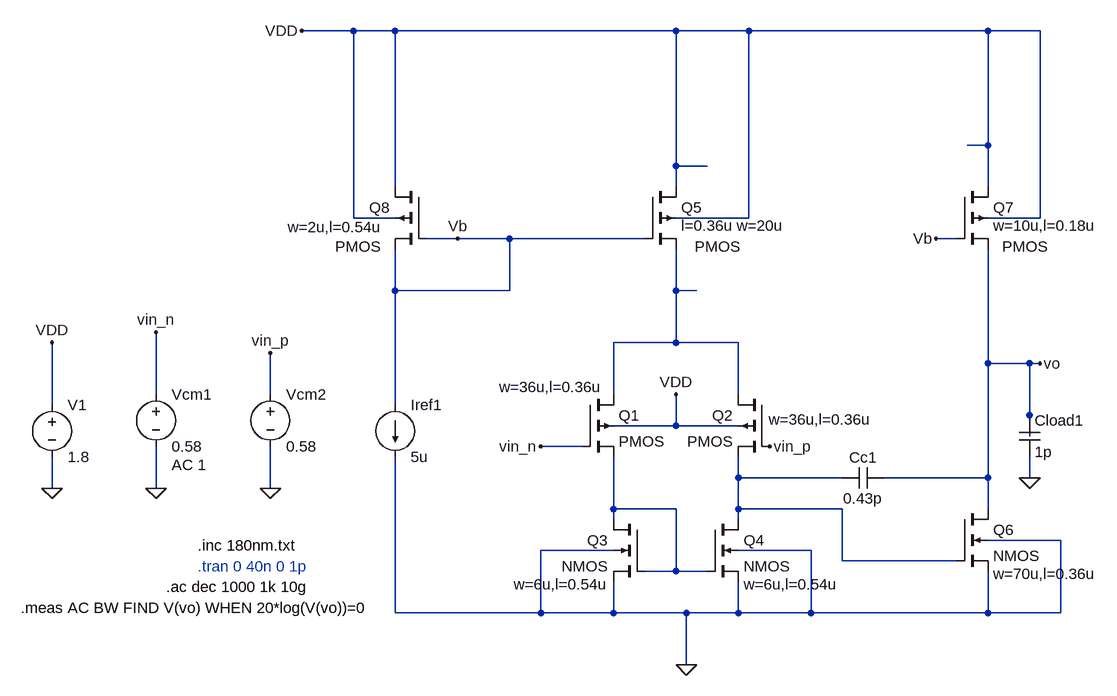
[diagram p0: schematic 55db 180mhz 62degree.asc]
55db 180mhz 62degree.asc, the LTspice schematic file:
Version 4
SHEET 1 1592 680
WIRE -400 -448 -480 -448
WIRE -336 -448 -400 -448
WIRE 96 -448 -336 -448
WIRE 208 -448 96 -448
WIRE 576 -448 208 -448
WIRE 656 -448 576 -448
WIRE 576 -272 576 -448
WIRE 576 -272 544 -272
WIRE 96 -240 96 -448
WIRE 144 -240 96 -240
WIRE -336 -208 -336 -448
WIRE 96 -208 96 -240
WIRE 576 -208 576 -272
WIRE -400 -160 -400 -448
WIRE -336 -160 -400 -160
WIRE 208 -160 208 -448
WIRE 208 -160 96 -160
WIRE 656 -160 656 -448
WIRE 656 -160 576 -160
WIRE -240 -128 -288 -128
WIRE -160 -128 -240 -128
WIRE 48 -128 -160 -128
WIRE 528 -128 496 -128
WIRE -336 -48 -336 -112
WIRE -160 -48 -160 -128
WIRE -160 -48 -336 -48
WIRE 96 -48 96 -112
WIRE 128 -48 96 -48
WIRE 96 32 96 -48
WIRE 96 32 0 32
WIRE 192 32 96 32
WIRE 576 64 576 -112
WIRE 640 64 576 64
WIRE 656 64 640 64
WIRE -704 112 -704 16
WIRE -528 112 -528 48
WIRE 0 112 0 32
WIRE 192 112 192 32
WIRE -864 128 -864 32
WIRE -336 128 -336 -48
WIRE 640 144 640 64
WIRE 96 160 96 112
WIRE 96 160 0 160
WIRE 192 160 96 160
WIRE 640 176 640 144
WIRE -48 192 -112 192
WIRE 192 240 192 208
WIRE 352 240 192 240
WIRE 576 240 576 64
WIRE 576 240 416 240
WIRE 640 240 640 208
WIRE -864 256 -864 208
WIRE -704 256 -704 192
WIRE -528 256 -528 192
WIRE 0 288 0 208
WIRE 96 288 0 288
WIRE 192 288 192 240
WIRE 352 288 192 288
WIRE 576 288 576 240
WIRE 0 304 0 288
WIRE 192 304 192 288
WIRE 688 336 576 336
WIRE 0 352 -112 352
WIRE 304 352 192 352
WIRE 352 368 352 288
WIRE 528 368 352 368
WIRE 96 384 96 288
WIRE 96 384 48 384
WIRE 144 384 96 384
WIRE -336 448 -336 208
WIRE -112 448 -112 352
WIRE -112 448 -336 448
WIRE 0 448 0 400
WIRE 0 448 -112 448
WIRE 112 448 0 448
WIRE 192 448 192 400
WIRE 192 448 112 448
WIRE 304 448 304 352
WIRE 304 448 192 448
WIRE 576 448 576 384
WIRE 576 448 304 448
WIRE 688 448 688 336
WIRE 688 448 576 448
WIRE 112 528 112 448
FLAG -112 192 vin_n
FLAG 240 192 vin_p
FLAG -480 -448 VDD
FLAG 656 64 vo
FLAG -704 256 0
FLAG -528 256 0
FLAG -528 48 vin_p
FLAG -864 256 0
FLAG -864 32 VDD
FLAG 640 240 0
FLAG 112 528 0
FLAG 96 112 VDD
FLAG -240 -128 Vb
FLAG 496 -128 Vb
FLAG -704 16 vin_n
DATAFLAG 96 -48 ""
DATAFLAG 576 64 ""
DATAFLAG 432 368 ""
DATAFLAG 64 288 ""
DATAFLAG 544 -272 "Id(Q7)"
DATAFLAG -128 -128 ""
DATAFLAG 144 -240 "Id(Q2)"
DATAFLAG 0 32 "Id(Q4)"
SYMBOL pmos4 -288 -208 M0
WINDOW 3 70 92 Left 2
WINDOW 123 68 62 Left 2
SYMATTR Value2 w=2u,l=0.54u
SYMATTR InstName Q8
SYMBOL pmos4 48 -208 R0
WINDOW 3 77 92 Left 2
WINDOW 123 56 60 Left 2
SYMATTR Value2 l=0.36u w=20u
SYMATTR InstName Q5
SYMBOL pmos4 528 -208 R0
WINDOW 3 70 92 Left 2
WINDOW 123 56 60 Left 2
SYMATTR Value2 w=10u,l=0.18u
SYMATTR InstName Q7
SYMBOL pmos4 -48 112 R0
WINDOW 123 287 38 Left 2
SYMATTR Value2 w=36u,l=0.36u
SYMATTR InstName Q1
SYMBOL pmos4 240 112 M0
WINDOW 123 257 -12 Left 2
SYMATTR Value2 w=36u,l=0.36u
SYMATTR InstName Q2
SYMBOL nmos4 48 304 M0
WINDOW 123 56 100 Left 2
SYMATTR Value2 w=6u,l=0.54u
SYMATTR InstName Q3
SYMBOL nmos4 144 304 R0
WINDOW 123 56 100 Left 2
SYMATTR Value2 w=6u,l=0.54u
SYMATTR InstName Q4
SYMBOL nmos4 528 288 R0
WINDOW 123 56 100 Left 2
SYMATTR Value2 w=70u,l=0.36u
SYMATTR InstName Q6
SYMBOL cap 416 224 R90
WINDOW 0 0 32 VBottom 2
WINDOW 3 32 32 VTop 2
SYMATTR InstName Cc1
SYMATTR Value 0.43p
SYMBOL voltage -704 96 R0
WINDOW 123 24 124 Left 2
WINDOW 39 0 0 Left 0
SYMATTR Value2 AC 1
SYMATTR InstName Vcm1
SYMATTR Value 0.58
SYMBOL voltage -528 96 R0
WINDOW 123 24 124 Left 2
WINDOW 39 0 0 Left 0
SYMATTR InstName Vcm2
SYMATTR Value 0.58
SYMBOL voltage -864 112 R0
SYMATTR InstName V1
SYMATTR Value 1.8
SYMBOL current -336 128 R0
WINDOW 123 0 0 Left 0
WINDOW 39 0 0 Left 0
SYMATTR InstName Iref1
SYMATTR Value 5u
SYMBOL cap 624 144 R0
SYMATTR InstName Cload1
SYMATTR Value 1p
TEXT -640 344 Left 2 !.inc 180nm.txt
TEXT -688 408 Left 2 !.ac dec 1000 1k 10g
TEXT -912 440 Left 2 !.meas AC BW FIND V(vo) WHEN 20*log(V(vo))=0
TEXT -640 376 Left 2 ;.tran 0 40n 0 1p

The netlist it stands for:
* 55db 180mhz 62degree.asc
M§Q8 VDD Vb Vb VDD PMOS w=2u,l=0.54u
M§Q5 VDD Vb N001 VDD PMOS l=0.36u w=20u
M§Q7 VDD Vb vo VDD PMOS w=10u,l=0.18u
M§Q1 N001 vin_n N003 VDD PMOS w=36u,l=0.36u
M§Q2 N001 vin_p N002 VDD PMOS w=36u,l=0.36u
M§Q3 N003 N003 0 0 NMOS w=6u,l=0.54u
M§Q4 N002 N003 0 0 NMOS w=6u,l=0.54u
M§Q6 vo N002 0 0 NMOS w=70u,l=0.36u
Cc1 vo N002 0.43p
Vcm1 vin_n 0 0.58 AC 1
Vcm2 vin_p 0 0.58
V1 VDD 0 1.8
Iref1 Vb 0 5u
Cload1 vo 0 1p
.model NMOS NMOS
.model PMOS PMOS
.lib standard.mos
.inc 180nm.txt
.ac dec 1000 1k 10g
.meas AC BW FIND V(vo) WHEN 20*log(V(vo))=0
* .tran 0 40n 0 1p
.backanno
.end